# Altium schematic sheet 1WB_DS2406_PROTECTED.SchDoc: Protected 1-Wire EEPROM
size A4; SheetNumber: 1; SheetTotal: 100; Organization: Altium Limited.; Address1: Level 3, 12a Rodborough Rd; Address2: Frenchs Forest 2086; Address3: NSW; Address4: AUSTRALIA
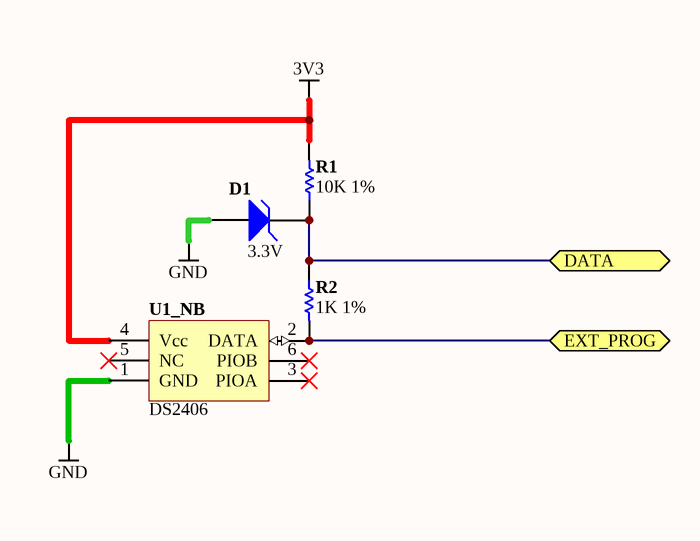
[diagram p0: 1WB_DS2406_PROTECTED.SchDoc]

## Parts
D1  3.3V  [SOT95P230-3D]
R1  10K 1%  [RESC1005-STAR]
R2  1K 1%  [RESC1005-STAR]
U1_NB  DS2406  [TSOC6]

## Ports
DATA, EXT_PROG (bidir)

## Nets
3V3: R1.2 U1_NB.4(Vcc)
GND: D1.1(A) U1_NB.1(GND)
DATA: D1.2(K) R1.1 R2.1 ; port DATA
EXT_PROG: R2.2 U1_NB.2(DATA) ; port EXT_PROG

Not connected (* = marked no-connect by the designer): U1_NB 3(PIOA)* 5(NC)* 6(PIOB)*

## Notes on the sheet
- Sheet Title
- Project Title
- Size:
- Date:
- A4
- Assy:
- Time:
- Revision:
- Sheet
- of
- File:

## Library data of the parts
D1 = D-150-0005: Zener Diode, 3.3V; Max Forward Current: mA; Mounting Technology: Surface Mount; Rated Voltage: 3.3 V; Status: Production; Category: Diode-Zener
R1 = D-100-0130: Resistor, 10K 1% 0402 (1005); Power Rating: 63 mW; Category: Resistor; Mounting Technology: Surface Mount; Resistance: 10 K; Status: Production; Tolerance: 1 %
R2 = D-100-0121: Resistor, 1K 1% 0402 (1005); Power Rating: 63 mW; Category: Resistor; Mounting Technology: Surface Mount; Resistance: 1 K; Status: Production; Tolerance: 1 %
U1_NB = D-263-0002: Dual Addressable Switch Plus 1KB Memory; Note: Pin numbers 4-6 are Not Connected (NC); Bit Length: Bits; Speed: ps; Supply Voltage: mV; Published: 13-Oct-2000; LatestRevisionDate: 17-Jul-2002; LatestRevisionNote: Re-released for DXP Platform.; DatasheetVersion: 22-Oct-1999; PackageVersion: 1999; PackageReference: TSOC6; Publisher: Altium Limited; PackageDescription: Small Outline; 6 C-Bend Leads; Body Width 3.8 mm; Pitch 1.27 mm; ComponentLink1Description: Manufacturer Link; ComponentLink1URL: http://www.maxim-ic.com/; ComponentLink2Description: Datasheet; ComponentLink2URL: http://pdfserv.maxim-ic.com/en/ds/DS2405.pdf; Bit Width: Bits; Mounting Technology: Surface Mount; Status: Unreleased; Technology: None; Category: IC-PROM